# Altium schematic sheet H1FR7x_Frontend 1.SchDoc
size Letter; CompanyName: Hexabitz; DocumentNumber: 2; SheetNumber: 2; SheetTotal: 3
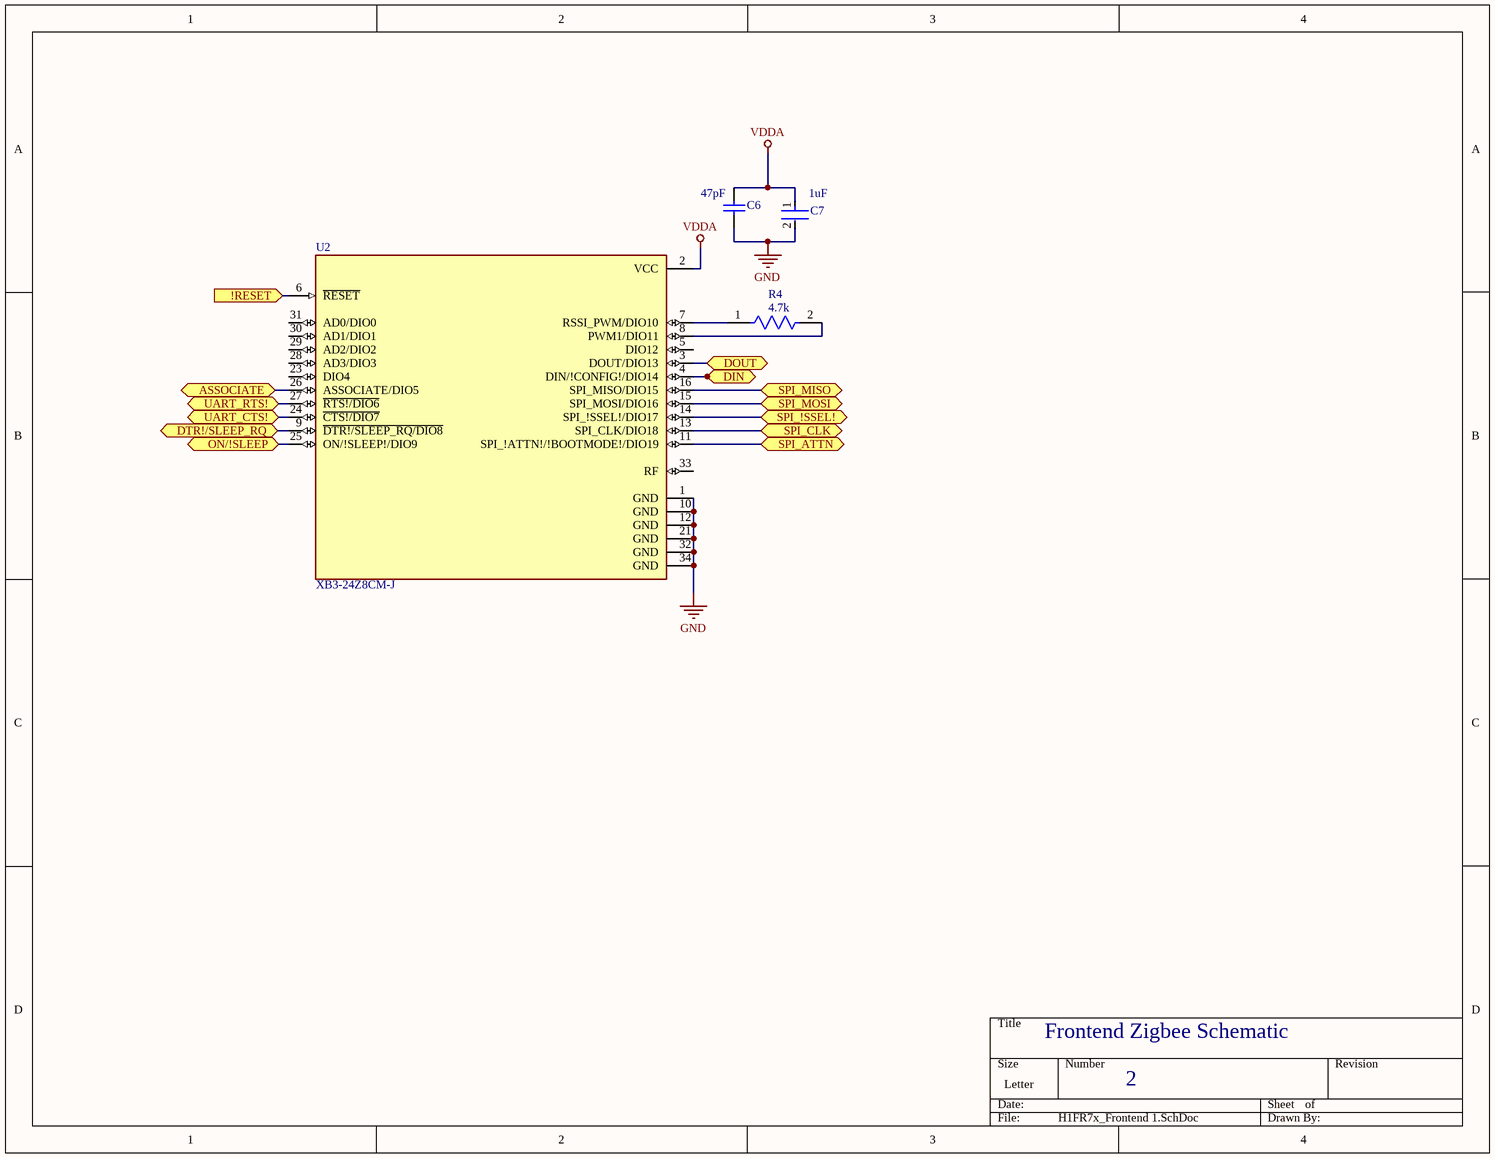
[diagram p0: H1FR7x_Frontend 1.SchDoc]

## Parts
C6  value 47pF  [CAPC1608X90X35NL15T15]  (hidden comment: 06035A470GAT2A)
C7  Capacitance: 1uF  [FP-C0603X105J9RACAUTO-MFG]  (hidden comment: C0603X105J9RACAUTO)
R4  value 4.7k  [FP-TFCR0603-IPC_B]  (hidden comment: TFCR0603-10W-C-4701FT)
U2  XB3-24Z8CM-J  [XCVR_XB3-24Z8CM-J]

## Ports
!RESET (in), ASSOCIATE (bidir), DIN (bidir), DOUT (bidir), DTR!/SLEEP_RQ (bidir), ON/!SLEEP (bidir), SPI_!SSEL! (bidir), SPI_ATTN (bidir), SPI_CLK (bidir), SPI_MISO (bidir), SPI_MOSI (bidir), UART_CTS! (bidir), UART_RTS! (bidir)

## Nets
GND: C6.1 C7.2 U2.1(GND) U2.10(GND) U2.12(GND) U2.21(GND) U2.32(GND) U2.34(GND)
VDDA: C6.2 C7.1 U2.2(VCC)
!RESET: U2.6(~{RESET}) ; port !RESET
ASSOCIATE: U2.26(ASSOCIATE/DIO5) ; port ASSOCIATE
DIN: U2.4(DIN/!CONFIG!/DIO14) ; port DIN
DOUT: U2.3(DOUT/DIO13) ; port DOUT
DTR!/SLEEP_RQ: U2.9(~{DTR!/SLEEP_RQ/DIO8}) ; port DTR!/SLEEP_RQ
ON/!SLEEP: U2.25(ON/!SLEEP!/DIO9) ; port ON/!SLEEP
SPI_!SSEL!: U2.14(SPI_!SSEL!/DIO17) ; port SPI_!SSEL!
SPI_ATTN: U2.11(SPI_!ATTN!/!BOOTMODE!/DIO19) ; port SPI_ATTN
SPI_CLK: U2.13(SPI_CLK/DIO18) ; port SPI_CLK
SPI_MISO: U2.16(SPI_MISO/DIO15) ; port SPI_MISO
SPI_MOSI: U2.15(SPI_MOSI/DIO16) ; port SPI_MOSI
UART_CTS!: U2.24(~{CTS!/DIO7}) ; port UART_CTS!
UART_RTS!: U2.27(~{RTS!/DIO6}) ; port UART_RTS!
NetR4_1: R4.1 U2.7(RSSI_PWM/DIO10)
NetR4_2: R4.2 U2.8(PWM1/DIO11)

Not connected (* = marked no-connect by the designer): U2 5(DIO12) 23(DIO4) 28(AD3/DIO3) 29(AD2/DIO2) 30(AD1/DIO1) 31(AD0/DIO0) 33(RF)

## Notes on the sheet
- Frontend Zigbee Schematic
- 2
- Module:
- Title:
- Description:
- Size:
- Revision:
- Letter
- www.hexabitz.com
- Date:
- Time:
- Sheet
- of

## Library data of the parts
C6 = CMP-2006-04315-1: 47pF; Manufacturer: AVX Interconnect / Elco; Part Number: 06035A470GAT2A
C7 = CMP-03020-034711-1: CAP CER 1UF 6.3V X7R 0603; Tolerance: 5%; Case Code (Metric): 1608; Packaging: Cut Tape; Voltage Rating: 6.3V; Ratings: AEC-Q200; Case Code (Imperial): 0603; Features: Soft Termination; Min Operating Temperature: -55°C; Max Operating Temperature: 125°C; Series: FT-CAP; Mount: Surface Mount; RoHS Compliant: Yes; Case/Package: 0603
R4 = CMP-250906-287647-1: RES Thin Film,  4.7kΩ, 1%, 0.1W, 50ppm/°C, 0603
U2 = XB3-24Z8CM-J: 802.15.4 ZigbeeÂ® Transceiver Module 2.4GHz Integrated, Chip Surface Mount; MF: Digi International; Price: None; Availability: Unavailable; SnapEDA_Link: https://www.snapeda.com/parts/XB3-24Z8CM-J/Digi%20International/view-part/2597885/?ref=snap; Value: *; Package: SMD-34 Digi International; MP: XB3-24Z8CM-J